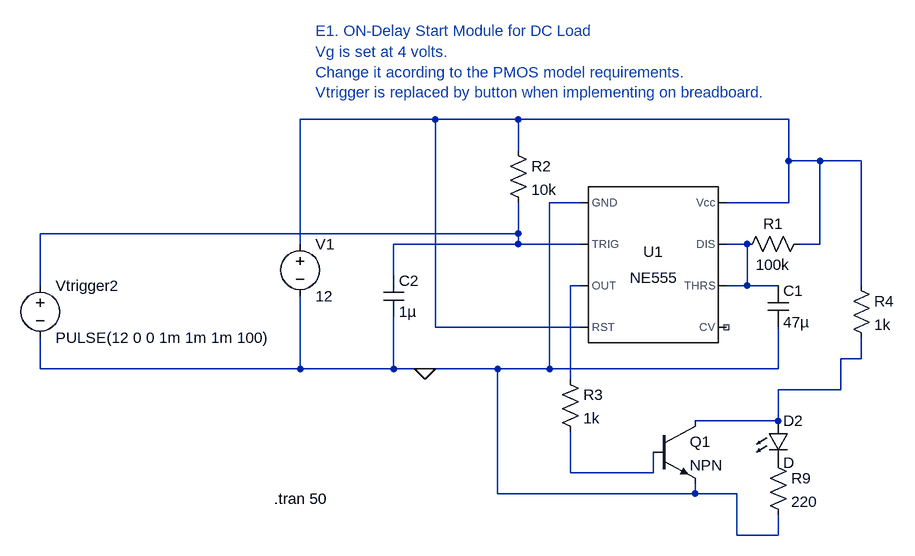
[diagram p0: schematic ON-Delay Start Module for DC Load .asc]
ON-Delay Start Module for DC Load .asc, the LTspice schematic file:
Version 4
SHEET 1 2572 680
WIRE 528 -160 320 -160
WIRE 656 -160 528 -160
WIRE 1072 -160 656 -160
WIRE 656 -112 656 -160
WIRE 1072 -96 1072 -160
WIRE 1120 -96 1072 -96
WIRE 1184 -96 1120 -96
WIRE 752 -32 704 -32
WIRE 1072 -32 1072 -96
WIRE 1072 -32 976 -32
WIRE 656 16 656 -32
WIRE 656 16 -80 16
WIRE 320 32 320 -160
WIRE 656 32 656 16
WIRE 656 32 464 32
WIRE 752 32 656 32
WIRE 1008 32 976 32
WIRE 1120 32 1120 -96
WIRE 1120 32 1088 32
WIRE 464 80 464 32
WIRE -80 96 -80 16
WIRE 752 96 736 96
WIRE 1008 96 1008 32
WIRE 1008 96 976 96
WIRE 1056 96 1008 96
WIRE 1184 96 1184 -96
WIRE 528 160 528 -160
WIRE 752 160 528 160
WIRE 1184 208 1184 176
WIRE 1184 208 1152 208
WIRE -80 224 -80 176
WIRE 320 224 320 112
WIRE 320 224 -80 224
WIRE 464 224 464 144
WIRE 464 224 320 224
WIRE 512 224 464 224
WIRE 624 224 512 224
WIRE 704 224 704 -32
WIRE 704 224 624 224
WIRE 1056 224 1056 160
WIRE 1056 224 704 224
WIRE 736 240 736 96
WIRE 1152 256 1152 208
WIRE 1152 256 1056 256
WIRE 1056 304 1056 256
WIRE 1056 304 928 304
WIRE 736 384 736 320
WIRE 864 384 864 352
WIRE 864 384 736 384
WIRE 624 416 624 224
WIRE 928 416 928 400
WIRE 928 416 624 416
WIRE 992 416 928 416
WIRE 992 480 992 416
WIRE 1056 480 1056 448
WIRE 1056 480 992 480
FLAG 512 224 0
SYMBOL Misc\\NE555 864 64 R0
SYMATTR InstName U1
SYMBOL voltage 320 16 R0
SYMATTR InstName V1
SYMATTR Value 12
SYMBOL res 1104 16 R90
WINDOW 0 0 56 VBottom 2
WINDOW 3 32 56 VTop 2
SYMATTR InstName R1
SYMATTR Value 100k
SYMBOL cap 1040 96 R0
SYMATTR InstName C1
SYMATTR Value 47µ
SYMBOL res 640 -128 R0
SYMATTR InstName R2
SYMATTR Value 10k
SYMBOL res 720 224 R0
SYMATTR InstName R3
SYMATTR Value 1k
SYMBOL res 1168 80 R0
SYMATTR InstName R4
SYMATTR Value 1k
SYMBOL cap 448 80 R0
SYMATTR InstName C2
SYMATTR Value 1µ
SYMBOL voltage -80 80 R0
SYMATTR InstName Vtrigger2
SYMATTR Value PULSE(12 0 0 1m 1m 1m 100)
SYMBOL LED 1040 304 R0
SYMATTR InstName D2
SYMBOL res 1040 352 R0
SYMATTR InstName R9
SYMATTR Value 220
SYMBOL npn 864 304 R0
SYMATTR InstName Q1
TEXT 280 424 Left 2 !.tran 50
TEXT 344 -264 Left 2 ;Vg is set at 4 volts. \nChange it acording to the PMOS model requirements.\nVtrigger is replaced by button when implementing on breadboard.
TEXT 344 -296 Left 2 ;E1. ON-Delay Start Module for DC Load

The netlist it stands for:
* ON-Delay Start Module for DC Load .asc
XU1 0 N002 N004 N001 NC_01 N003 N003 N001 NE555  ; pins GND TRIG OUT RST CV THRS DIS Vcc
V1 N001 0 12
R1 N001 N003 100k
C1 N003 0 47µ
R2 N001 N002 10k
R3 N004 N006 1k
R4 N001 N005 1k
C2 N002 0 1µ
Vtrigger2 N002 0 PULSE(12 0 0 1m 1m 1m 100)
D2 N005 P001 D
R9 P001 0 220
Q1 N005 N006 0 0 NPN
.model D D
.lib standard.dio
.model NPN NPN
.model PNP PNP
.lib standard.bjt
.tran 50
* Vg is set at 4 volts.
* Change it acording to the PMOS model requirements.
* Vtrigger is replaced by button when implementing on breadboard.
* E1. ON-Delay Start Module for DC Load
.lib NE555.sub
.backanno
.end